# Altium schematic sheet BootCon.SchDoc
size A4; SheetNumber: 3; SheetTotal: 11
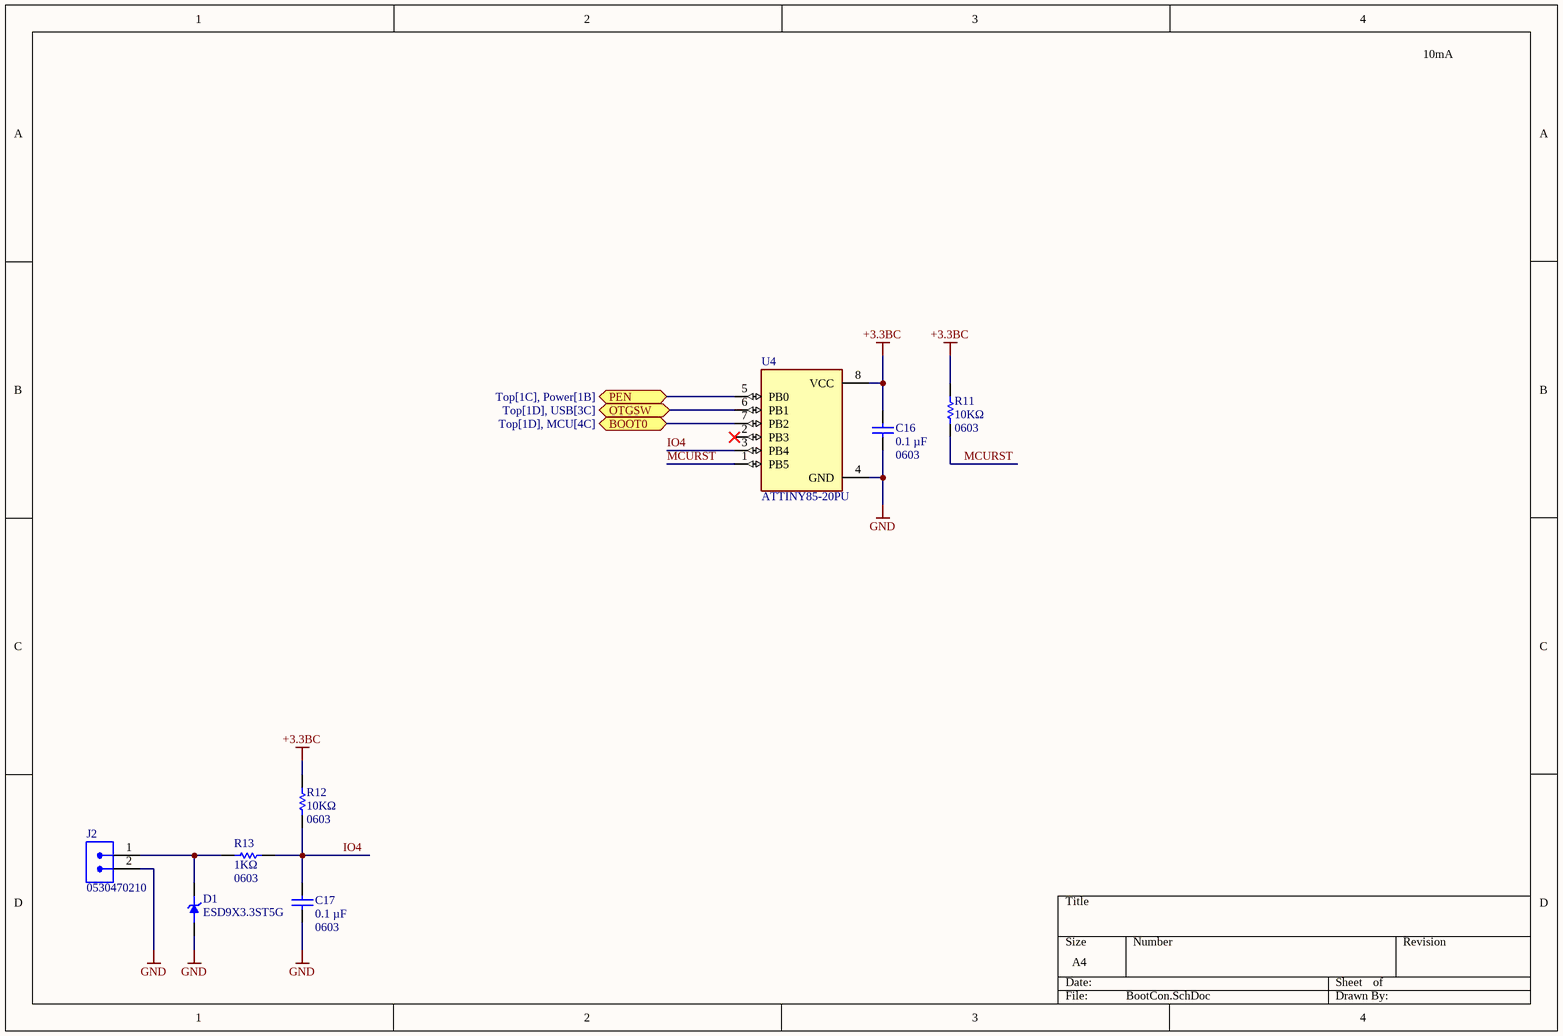
[diagram p0: BootCon.SchDoc]

## Parts
C16  value 0.1 µF  [0603]  (hidden comment: GRM188R72A104MA35J)
C17  value 0.1 µF  [0603]  (hidden comment: GRM188R72A104MA35J)
D1  ESD9X3.3ST5G  [SOD923]
J2  0530470210  [2POS]
R11  value 10KΩ  [0603]  (hidden comment: RMCF0603FG10K0)
R12  value 10KΩ  [0603]  (hidden comment: RMCF0603FG10K0)
R13  value 1KΩ  [0603]  (hidden comment: RMCF0603FG1K00)
U4  ATTINY85-20PU  [DIP8]

## Ports
BOOT0 (bidir, see Top[1D], MCU[4C]), OTGSW (bidir, see Top[1D], USB[3C]), PEN (bidir, see Top[1C], Power[1B])

## Nets
+3.3BC: C16.1 R11.2 R12.2 U4.8(VCC)
GND: C16.2 C17.2 D1.2(A) J2.2 U4.4(GND)
BOOT0: U4.7(PB2) ; port BOOT0
IO4: C17.1 R12.1 R13.1 U4.3(PB4)
MCURST: R11.1 U4.1(PB5)
OTGSW: U4.6(PB1) ; port OTGSW
PEN: U4.5(PB0) ; port PEN
NetD1_1: D1.1(K) J2.1 R13.2

Not connected (* = marked no-connect by the designer): U4 2(PB3)*

## Notes on the sheet
- 10mA

## Library data of the parts
C16 C17 = GRM188R72A104MA35J: 0.1 µF ±20% 100V Ceramic Capacitor X7R 0603 (1608 Metric); Case: 0603; Tolerance: ±20%; Temperature Coefficient: X7R; Voltage: 100V
D1 = ESD9X3.3ST5G: 10.4V Clamp 9.8A (8/20µs) Ipp Tvs Diode Surface Mount SOD-923; Reverse Standoff: 3.3V; Breakdown: 5V; Peak Pulse: 102W; Clamping: 10.4V
J2 = 0530470210: Connector Header Through Hole 2 position 0.049" (1.25mm)
R11 R12 = RMCF0603FG10K0: 10 kOhms ±1% 0.1W, 1/10W Chip Resistor 0603 (1608 Metric) Automotive AEC-Q200 Thick Film; Case: 0603; Tolerance: 1%; Power: 0.1W
R13 = RMCF0603FG1K00: 1 kOhms ±1% 0.1W, 1/10W Chip Resistor 0603 (1608 Metric) Automotive AEC-Q200 Thick Film; Case: 0603; Tolerance: 1%; Power: 0.1W
U4 = ATTINY85-20PU: AVR AVR® ATtiny, Functional Safety (FuSa) Microcontroller IC 8-Bit 20MHz 8KB (4K x 16) FLASH 8-PDIP